# EAGLE design MotorBrackets (EAGLE 7.3.0)
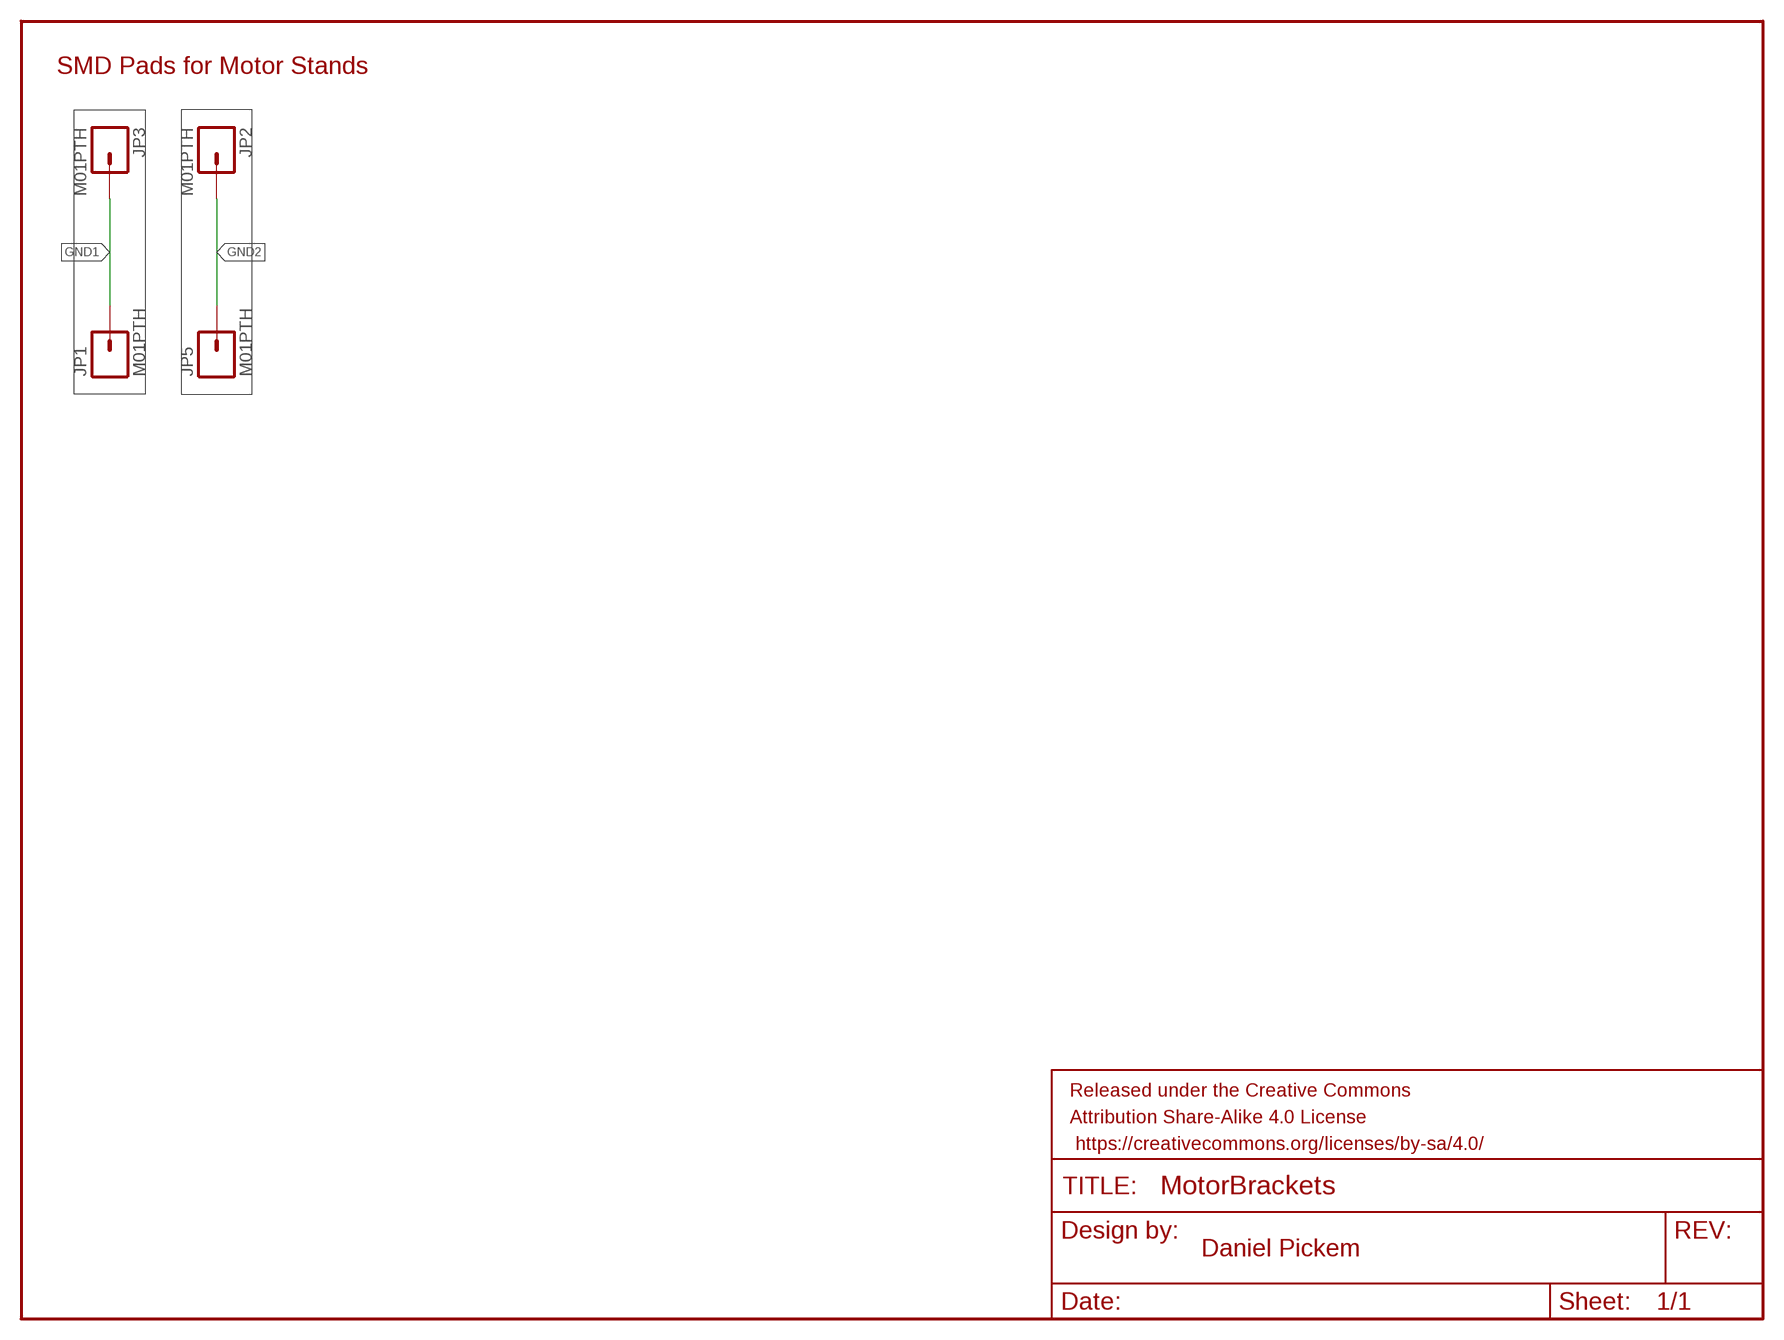
[diagram p0: schematic, sheet 1]

## Parts
FRAME1  FRAME-LETTER  [CREATIVE_COMMONS]
JP1  M01PTH  [1X01]
JP2  M01PTH  [1X01]
JP3  M01PTH  [1X01]
JP5  M01PTH  [1X01]

## Nets
GND1: JP1.1 JP3.1
GND2: JP2.1 JP5.1

## Notes on the sheet
- SMD Pads for Motor Stands
- Daniel Pickem

## Library data of the parts
FRAME1 = GRITSBot:FRAME-LETTER: Schematic Frame Standard 8.5x11 US Letter frame
JP1-JP3 JP5 = SparkFun-Connectors:M01: Header 1 Standard 1-pin 0.1" header. Use with straight break away headers (SKU : PRT-00116), right angle break away headers (PRT-00553), swiss pins (PRT-00743), machine pins (PRT-00117), and female headers (PRT-00115).

## Net classes
1 power: width 0.381 mm, clearance 0.254 mm

## Board
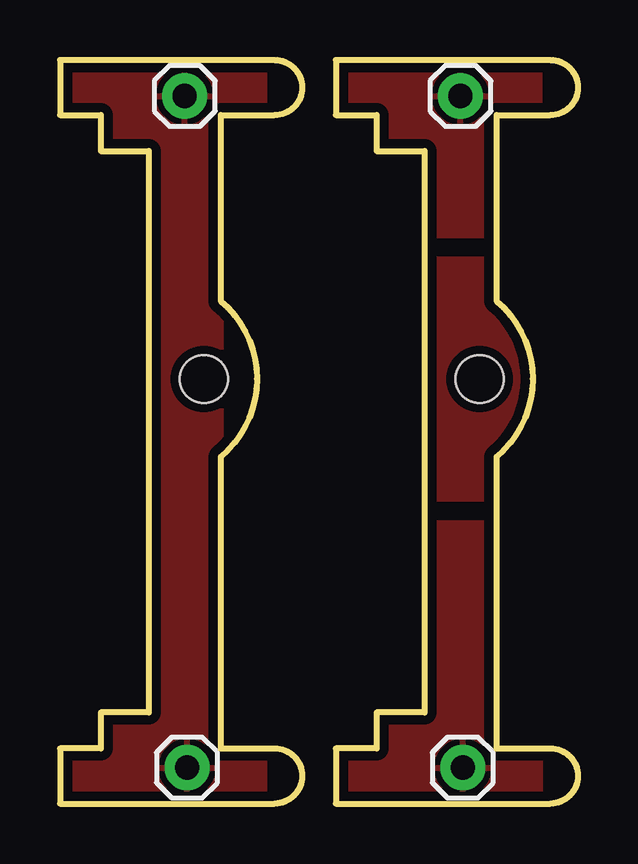
[diagram p1: board, top side]
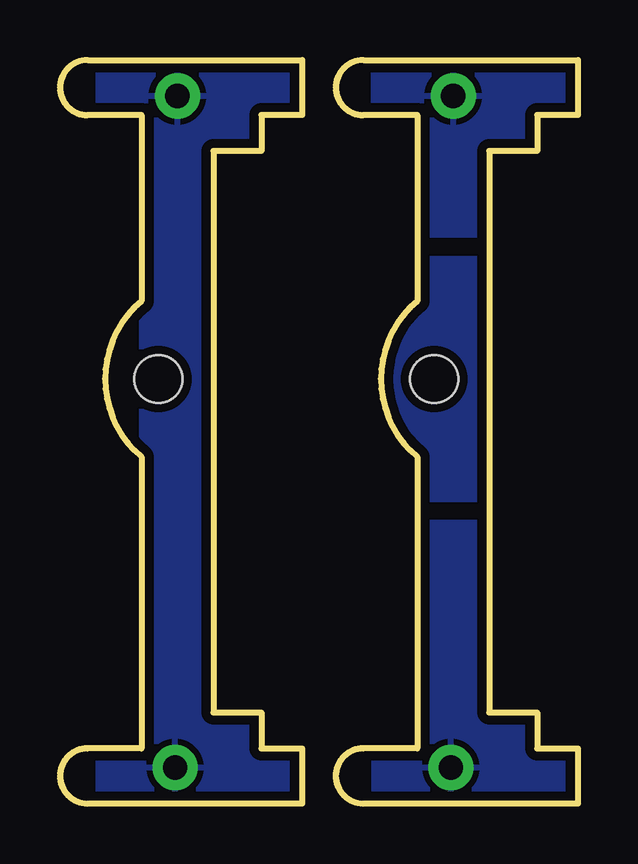
[diagram p2: board, bottom side, seen from below]

Size 21.6 x 31 mm. Coordinates in mm from the lower left corner, seen from the top.
Outline: 8.95,31 0,31 0,28.7 1.7,28.7 1.7,27.2 3.7,27.2 3.7,3.8 1.7,3.8 1.7,2.3 0,2.3 0,0 8.95,0 arc180 8.95,2.3 6.7,2.3 6.7,14.45 arc100 6.7,20.95 6.7,28.7 8.95,28.7 arc180 8.95,31
Outline: 20.45,31 11.5,31 11.5,28.7 13.2,28.7 13.2,27.2 15.2,27.2 15.2,3.8 13.2,3.8 13.2,2.3 11.5,2.3 11.5,0 20.45,0 arc180 20.45,2.3 18.2,2.3 18.2,14.45 arc100 18.2,20.95 18.2,28.7 20.45,28.7 arc180 20.45,31
Copper layers (1*16): Top 0.0356mm / dielectric 1.5011mm / Bottom 0.0356mm
Design rules "LaenPCBOrder": minimum track width 6mil, minimum drill 13mil, track to track 6mil, track to pad 6mil, pad to pad 6mil, via to via 6mil, smd to smd 6mil, copper to edge 15mil, drill to drill 6mil, minimum pad ring 7mil, minimum via ring 7mil, stop-mask expansion 3mil, vias tented up to drill 0mil, thermal gap 10mil
Holes 2 mm at 6,17.7 17.5,17.7

### Footprints (pad centres in the part's own frame; a part is rotated, then mirrored left to right if it is on the bottom)
1X01 = drill 1.016 pad 1.88: 1 0,0

### Placement (x,y rotation side)
FRAME1  0,0 0 top
JP1  5.3,1.5 0 top
JP2  16.7,29.5 0 top
JP3  5.2,29.5 0 top
JP5  16.8,1.5 0 top

### Tracks (layer width: path | path; a pad name or v marks a point on that pad's centre or on a via)
GND1
  pour Top: 0,0 0,2.3 1.7,2.3 1.7,3.8 3.7,3.8 3.7,27.2 1.7,27.2 1.7,28.7 0,28.7 0,31 8.5,31 8.5,28.7 6.7,28.7 6.7,2.3 8.5,2.3 8.5,0
  pour Bottom: 0,0 0,2.3 1.7,2.3 1.7,3.8 3.7,3.8 3.7,11.7 6.7,11.7 6.7,2.3 8.5,2.3 8.5,0
  pour Bottom: 0,31 0,28.7 1.7,28.7 1.7,27.2 3.7,27.2 3.7,23.7 6.7,23.7 6.7,28.7 8.5,28.7 8.5,31
GND2
  pour Top: 11.5,0 11.5,2.3 13.2,2.3 13.2,3.8 15.2,3.8 15.2,11.7 18.2,11.7 18.2,2.4 20,2.4 20,0
  pour Bottom: 11.5,0 11.5,2.3 13.2,2.3 13.2,3.8 15.2,3.8 15.2,27.2 13.2,27.2 13.2,28.7 11.5,28.7 11.5,31 20,31 20,28.7 18.2,28.7 18.2,2.3 20,2.3 20,0
  pour Top: 11.5,31 11.5,28.7 13.2,28.7 13.2,27.2 15.2,27.2 15.2,23.7 18.2,23.7 18.2,28.7 20,28.7 20,31
N$1
  pour Bottom: 3.7,22.7 6.7,22.7 6.7,20.9 6.7,20.7 6.9,20.7 6.9,20.4 7.2,20.4 7.2,20.1 7.4,20.1 7.4,19.9 7.6,19.9 7.6,19.5 7.8,19.5 7.8,19.1 8,19.1 8,18.7 8.1,18.7 8.1,18.2 8.2,18.2 8.2,17.3 8.1,17.3 8.1,16.7 8,16.7 8,16.3 7.9,16.3 7.9,16 7.7,16 7.7,15.8 7.6,15.8 7.6,15.6 7.4,15.6 7.4,15.3 7.2,15.3 7.2,15 6.9,15 6.9,14.7 6.7,14.7 6.7,14.5 6.7,12.7 3.7,12.7
N$4
  pour Top: 15.2,22.7 18.1,22.7 18.1,20.6 18.6,20.6 18.6,20 19,20 19,19.4 19.3,19.4 19.3,18.8 19.6,18.8 19.6,16.7 19.4,16.7 19.4,16.1 19.1,16.1 19.1,15.5 18.9,15.5 18.9,15.2 18.6,15.2 18.6,14.8 18.2,14.8 18.2,12.7 15.2,12.7

### Text on the board
tDocu: Released under the Creative Commons Attribution Share-Alike 4.0 License / https://creativecommons.org/licenses/by-sa/4.0/ | Designed by: Daniel Pickem (http://www.danielpickem.com/)